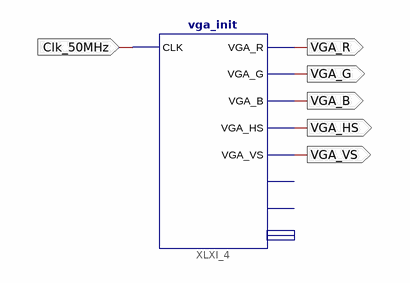
[diagram p0: schematic sheet 1]
// Xilinx ISE schematic schema_example2.sch (spartan3e) as structural Verilog: 1 symbols, 6 ports
module schema_example2 (
  input  Clk_50MHz,
  output VGA_R,
  output VGA_G,
  output VGA_B,
  output VGA_HS,
  output VGA_VS
);

  vga_init XLXI_4 (
    .CLK(Clk_50MHz), .VGA_R(VGA_R), .VGA_G(VGA_G), .VGA_B(VGA_B), .VGA_HS(VGA_HS), .VGA_VS(VGA_VS));  // open: AMP_WE, ADC_Start, AMP_DI
endmodule
